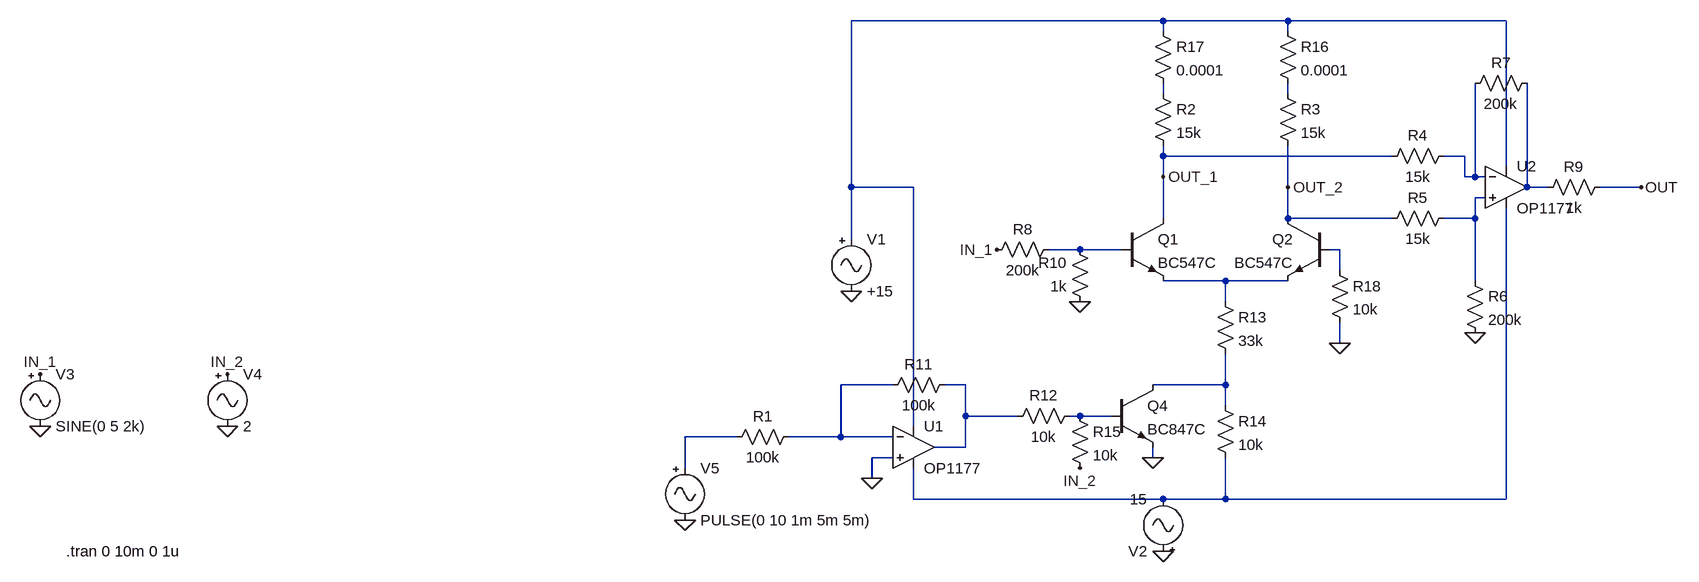
[diagram p0: schematic vca.asc]
vca.asc, the LTspice schematic file:
Version 4
SHEET 1 1084 680
WIRE 128 -192 -352 -192
WIRE 320 -192 128 -192
WIRE 656 -192 320 -192
WIRE 128 -176 128 -192
WIRE 320 -176 320 -192
WIRE 128 -80 128 -96
WIRE 320 -80 320 -96
WIRE 128 16 128 0
WIRE 480 16 128 16
WIRE 592 16 560 16
WIRE 656 32 656 -192
WIRE 128 48 128 16
WIRE 592 48 592 16
WIRE 608 48 608 -96
WIRE 608 48 592 48
WIRE 624 48 608 48
WIRE -352 64 -352 -192
WIRE -256 64 -352 64
WIRE 320 64 320 0
WIRE 688 64 688 -96
WIRE 720 64 688 64
WIRE 864 64 800 64
WIRE 624 80 608 80
WIRE 128 112 128 48
WIRE 320 112 320 64
WIRE 480 112 320 112
WIRE 608 112 608 80
WIRE 608 112 560 112
WIRE -352 144 -352 64
WIRE 0 160 -48 160
WIRE 64 160 0 160
WIRE 400 160 384 160
WIRE 400 192 400 160
WIRE 224 208 128 208
WIRE 320 208 224 208
WIRE 608 208 608 112
WIRE 224 240 224 208
WIRE 400 304 400 272
WIRE -288 368 -368 368
WIRE -176 368 -208 368
WIRE 224 368 224 320
WIRE 224 368 112 368
WIRE 224 400 224 368
WIRE -176 416 -176 368
WIRE -96 416 -176 416
WIRE 0 416 -16 416
WIRE 48 416 0 416
WIRE -256 432 -256 64
WIRE -528 448 -608 448
WIRE -368 448 -368 368
WIRE -368 448 -448 448
WIRE -288 448 -368 448
WIRE -176 464 -176 416
WIRE -176 464 -224 464
WIRE -288 480 -320 480
WIRE 112 480 112 464
WIRE -608 496 -608 448
WIRE -320 512 -320 480
WIRE -256 544 -256 496
WIRE 128 544 -256 544
WIRE 224 544 224 480
WIRE 224 544 128 544
WIRE 656 544 656 96
WIRE 656 544 224 544
FLAG -352 224 0
FLAG -1312 432 0
FLAG -1600 432 0
FLAG -1600 352 IN_1
FLAG -1312 352 IN_2
FLAG 128 48 OUT_1
FLAG 320 64 OUT_2
FLAG 608 288 0
FLAG 864 64 OUT
FLAG 128 624 0
FLAG -608 576 0
FLAG 0 240 0
FLAG -128 160 IN_1
FLAG -320 512 0
FLAG 112 480 0
FLAG 0 496 IN_2
FLAG 400 304 0
DATAFLAG 384 448 "I(R14)"
DATAFLAG 128 288 "I(R13)"
SYMBOL npn 64 112 R0
SYMATTR InstName Q1
SYMATTR Value BC547C
SYMBOL npn 384 112 M0
SYMATTR InstName Q2
SYMATTR Value BC547C
SYMBOL Misc\\signal -352 128 R0
WINDOW 123 0 0 Left 0
WINDOW 39 0 0 Left 0
SYMATTR InstName V1
SYMATTR Value +15
SYMBOL res 112 -96 R0
SYMATTR InstName R2
SYMATTR Value 15k
SYMATTR SpiceLine tol=1 pwr=0.25
SYMBOL res 304 -96 R0
SYMATTR InstName R3
SYMATTR Value 15k
SYMATTR SpiceLine tol=1 pwr=0.25
SYMBOL Misc\\signal -1600 336 R0
WINDOW 123 0 0 Left 0
WINDOW 39 0 0 Left 0
SYMATTR InstName V3
SYMATTR Value SINE(0 5 2k)
SYMBOL Misc\\signal -1312 336 R0
WINDOW 123 0 0 Left 0
WINDOW 39 0 0 Left 0
SYMATTR InstName V4
SYMATTR Value 2
SYMBOL Misc\\signal 128 640 R180
WINDOW 123 0 0 Left 0
WINDOW 39 0 0 Left 0
SYMATTR InstName V2
SYMATTR Value 15
SYMBOL res 576 0 R90
WINDOW 0 0 56 VBottom 2
WINDOW 3 32 56 VTop 2
SYMATTR InstName R4
SYMATTR Value 15k
SYMBOL res 576 96 R90
WINDOW 0 0 56 VBottom 2
WINDOW 3 32 56 VTop 2
SYMATTR InstName R5
SYMATTR Value 15k
SYMBOL res 592 192 R0
SYMATTR InstName R6
SYMATTR Value 200k
SYMBOL res 704 -112 R90
WINDOW 0 0 56 VBottom 2
WINDOW 3 32 56 VTop 2
SYMATTR InstName R7
SYMATTR Value 200k
SYMBOL res 816 48 R90
WINDOW 0 0 56 VBottom 2
WINDOW 3 32 56 VTop 2
SYMATTR InstName R9
SYMATTR Value 1k
SYMBOL OpAmps\\OP1177 656 0 R0
SYMATTR InstName U2
SYMBOL res -432 432 R90
WINDOW 0 0 56 VBottom 2
WINDOW 3 32 56 VTop 2
SYMATTR InstName R1
SYMATTR Value 100k
SYMBOL Misc\\signal -608 480 R0
WINDOW 123 0 0 Left 0
WINDOW 39 0 0 Left 0
SYMATTR InstName V5
SYMATTR Value PULSE(0 10 1m 5m 5m)
SYMBOL res -32 144 R90
WINDOW 0 0 56 VBottom 2
WINDOW 3 32 56 VTop 2
SYMATTR InstName R8
SYMATTR Value 200k
SYMBOL res 16 256 R180
WINDOW 0 36 76 Left 2
WINDOW 3 36 40 Left 2
SYMATTR InstName R10
SYMATTR Value 1k
SYMBOL OpAmps\\OP1177 -256 400 R0
SYMATTR InstName U1
SYMBOL res -192 352 R90
WINDOW 0 0 56 VBottom 2
WINDOW 3 32 56 VTop 2
SYMATTR InstName R11
SYMATTR Value 100k
SYMBOL npn 48 368 R0
SYMATTR InstName Q4
SYMATTR Value BC847C
SYMBOL res 0 400 R90
WINDOW 0 0 56 VBottom 2
WINDOW 3 32 56 VTop 2
SYMATTR InstName R12
SYMATTR Value 10k
SYMBOL res 208 224 R0
SYMATTR InstName R13
SYMATTR Value 33k
SYMBOL res 208 384 R0
SYMATTR InstName R14
SYMATTR Value 10k
SYMBOL res -16 400 R0
SYMATTR InstName R15
SYMATTR Value 10k
SYMBOL res 304 -192 R0
SYMATTR InstName R16
SYMATTR Value 0.0001
SYMBOL res 112 -192 R0
SYMATTR InstName R17
SYMATTR Value 0.0001
SYMBOL res 384 176 R0
SYMATTR InstName R18
SYMATTR Value 10k
TEXT -1560 624 Left 2 !.tran 0 10m 0 1u

The netlist it stands for:
* vca.asc
Q1 OUT_1 N007 N009 0 BC547C
Q2 OUT_2 N008 N009 0 BC547C
V1 N001 0 +15
R2 N002 OUT_1 15k tol=1 pwr=0.25
R3 N003 OUT_2 15k tol=1 pwr=0.25
V3 IN_1 0 SINE(0 5 2k)
V4 IN_2 0 2
V2 0 N015 15
R4 N004 OUT_1 15k
R5 N006 OUT_2 15k
R6 N006 0 200k
R7 N005 N004 200k
R9 OUT N005 1k
XU2 N006 N004 N001 N015 N005 OP1177  ; pins In+ In- V+ V- OUT
R1 N010 N014 100k
V5 N014 0 PULSE(0 10 1m 5m 5m)
R8 N007 IN_1 200k
R10 0 N007 1k
XU1 0 N010 N001 N015 N011 OP1177  ; pins In+ In- V+ V- OUT
R11 N011 N010 100k
Q4 N012 N013 0 0 BC847C
R12 N013 N011 10k
R13 N009 N012 33k
R14 N012 N015 10k
R15 N013 IN_2 10k
R16 N001 N003 0.0001
R17 N001 N002 0.0001
R18 N008 0 10k
.model NPN NPN
.model PNP PNP
.lib standard.bjt
.tran 0 10m 0 1u
.lib ADI1.lib
.backanno
.end